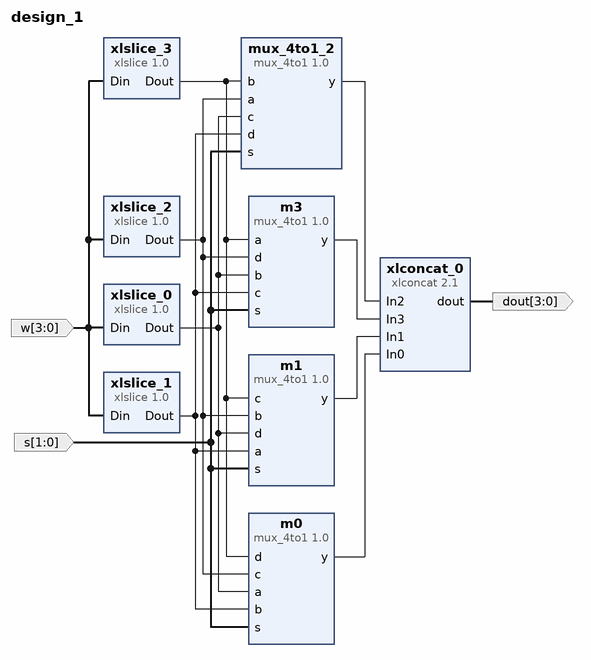
[diagram p0: block diagram of the top level]
# Vivado block design design_1, xc7a100tcsg324-1, Vivado 2022.2
create_bd_design design_1

create_bd_port -dir I -from 3 -to 0 w
create_bd_port -dir I -from 1 -to 0 s
create_bd_port -dir O -from 3 -to 0 dout

create_bd_cell -type ip -vlnv xilinx.com:user:mux_4to1:1.0 m0
create_bd_cell -type ip -vlnv xilinx.com:user:mux_4to1:1.0 m1
create_bd_cell -type ip -vlnv xilinx.com:user:mux_4to1:1.0 mux_4to1_2
create_bd_cell -type ip -vlnv xilinx.com:user:mux_4to1:1.0 m3
create_bd_cell -type ip -vlnv xilinx.com:ip:xlslice:1.0 xlslice_1
set_property -dict {CONFIG.DIN_FROM 1 CONFIG.DIN_TO 1 CONFIG.DIN_WIDTH 4} [get_bd_cells xlslice_1]
create_bd_cell -type ip -vlnv xilinx.com:ip:xlslice:1.0 xlslice_2
set_property -dict {CONFIG.DIN_FROM 2 CONFIG.DIN_TO 2 CONFIG.DIN_WIDTH 4} [get_bd_cells xlslice_2]
create_bd_cell -type ip -vlnv xilinx.com:ip:xlslice:1.0 xlslice_3
set_property -dict {CONFIG.DIN_FROM 3 CONFIG.DIN_TO 3 CONFIG.DIN_WIDTH 4} [get_bd_cells xlslice_3]
create_bd_cell -type ip -vlnv xilinx.com:ip:xlslice:1.0 xlslice_0
set_property -dict {CONFIG.DIN_WIDTH 4} [get_bd_cells xlslice_0]
create_bd_cell -type ip -vlnv xilinx.com:ip:xlconcat:2.1 xlconcat_0
set_property -dict {CONFIG.NUM_PORTS 4} [get_bd_cells xlconcat_0]

# ---- connections ----

connect_bd_net [get_bd_pins m0/y] [get_bd_pins xlconcat_0/In0]
connect_bd_net [get_bd_pins m1/y] [get_bd_pins xlconcat_0/In1]
connect_bd_net [get_bd_pins m3/y] [get_bd_pins xlconcat_0/In3]
connect_bd_net [get_bd_pins mux_4to1_2/y] [get_bd_pins xlconcat_0/In2]
connect_bd_net [get_bd_ports s] [get_bd_pins m3/s] [get_bd_pins mux_4to1_2/s] [get_bd_pins m1/s] [get_bd_pins m0/s]
connect_bd_net [get_bd_ports w] [get_bd_pins xlslice_1/Din] [get_bd_pins xlslice_0/Din] [get_bd_pins xlslice_2/Din] [get_bd_pins xlslice_3/Din]
connect_bd_net [get_bd_pins xlconcat_0/dout] [get_bd_ports dout]
connect_bd_net [get_bd_pins xlslice_0/Dout] [get_bd_pins m0/a] [get_bd_pins m1/d] [get_bd_pins mux_4to1_2/c] [get_bd_pins m3/b]
connect_bd_net [get_bd_pins xlslice_1/Dout] [get_bd_pins m1/a] [get_bd_pins m0/b] [get_bd_pins mux_4to1_2/d] [get_bd_pins m3/c]
connect_bd_net [get_bd_pins xlslice_2/Dout] [get_bd_pins mux_4to1_2/a] [get_bd_pins m1/b] [get_bd_pins m0/c] [get_bd_pins m3/d]
connect_bd_net [get_bd_pins xlslice_3/Dout] [get_bd_pins m3/a] [get_bd_pins mux_4to1_2/b] [get_bd_pins m1/c] [get_bd_pins m0/d]

validate_bd_design
save_bd_design
